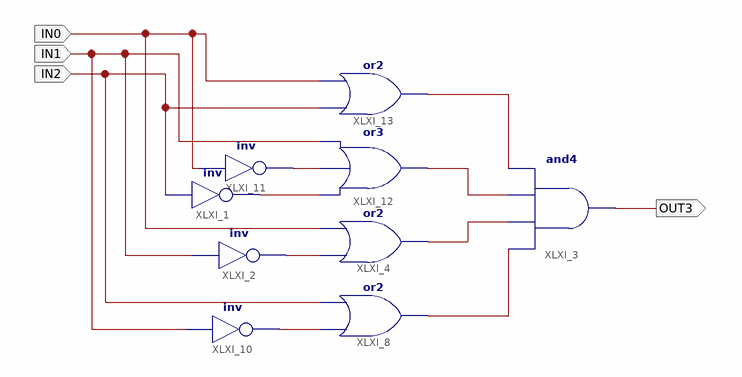
[diagram p0: schematic sheet 1]
// Xilinx ISE schematic Segmento3.sch (spartan3e) as structural Verilog: 9 symbols, 4 ports
module Segmento3 (
  input  IN0,
  input  IN2,
  input  IN1,
  output OUT3
);

  wire XLXN_43, XLXN_44, XLXN_49, XLXN_51, XLXN_53, XLXN_54, XLXN_55, XLXN_56;

  not XLXI_1 (XLXN_44, IN2);
  not XLXI_2 (XLXN_49, IN1);
  and XLXI_3 (OUT3, XLXN_56, XLXN_55, XLXN_54, XLXN_53);
  or XLXI_4 (XLXN_55, XLXN_49, IN0);
  or XLXI_8 (XLXN_56, XLXN_51, IN2);
  not XLXI_10 (XLXN_51, IN1);
  not XLXI_11 (XLXN_43, IN0);
  or XLXI_12 (XLXN_54, XLXN_44, XLXN_43, IN1);
  or XLXI_13 (XLXN_53, IN2, IN0);
endmodule
